# EAGLE design Final-V-0.1 (EAGLE 6.6.0)
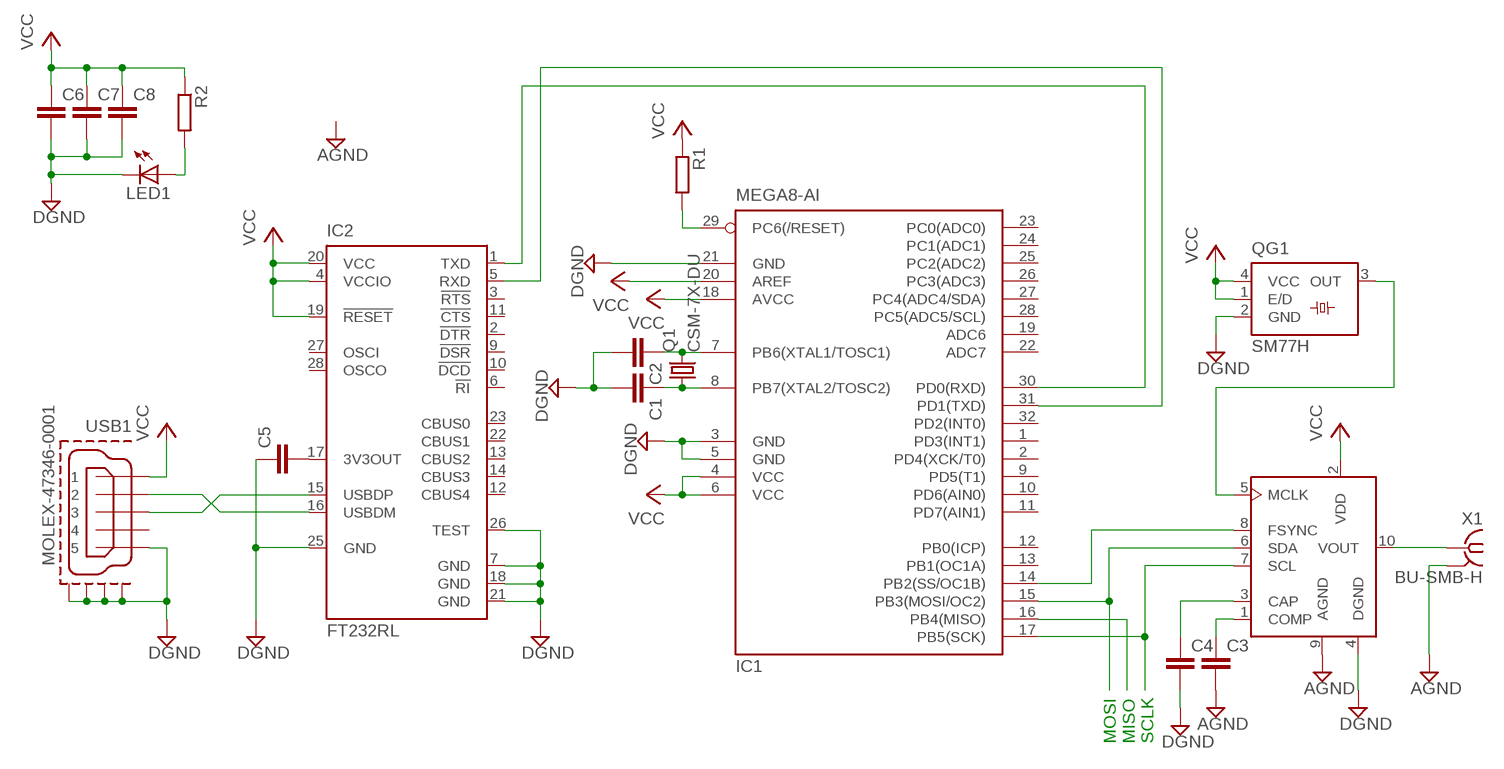
[diagram p0: schematic, sheet 1]

## Parts
C1  C-EUC1206K  [C1206K]
C2  C-EUC1206K  [C1206K]
C3  C-EUC1206K  [C1206K]
C4  C-EUC1206K  [C1206K]
C5  C-EUC1206K  [C1206K]
C6  C-EUC1206K  [C1206K]
C7  C-EUC1206K  [C1206K]
C8  C-EUC1206K  [C1206K]
IC1  MEGA8-AI  [TQFP32-08]
IC2  FT232RL  [SSOP28]
LED1  LEDSML1206  [SML1206]
Q1  CSM-7X-DU  [CSM-7X-DU]
QG1  SM77H  [SM77H]
R1  R-EU_M1206  [M1206]
R2  R-EU_M1206  [M1206]
U$1  AD9833-SMD  [MSOP10]
USB1  MOLEX-47346-0001  [MOLEX-47364-0001]
X1  BU-SMB-H  [BU-SMB-H]

## Nets
AGND: C3.2 U$1.9(AGND) X1.2 X1.3 X1.4 X1.5
DGND: C1.2 C2.2 C4.2 C5.1 C6.2 C7.2 C8.2 IC1.3(GND) IC1.5(GND) IC1.21(GND) IC2.7(GND) IC2.18(GND) IC2.21(GND) IC2.25(GND) IC2.26(TEST) LED1.C QG1.2(GND) U$1.4(DGND) USB1.5 USB1.GND1 USB1.GND2 USB1.GND3 USB1.GND4
N$1: C2.1 IC1.7(PB6(XTAL1/TOSC1)) Q1.2
N$2: C1.1 IC1.8(PB7(XTAL2/TOSC2)) Q1.1
N$3: C3.1 U$1.1(COMP)
N$4: IC1.17(PB5(SCK)) U$1.7(SCL)
N$5: IC1.29(PC6(/RESET)) R1.2
N$6: IC1.15(PB3(MOSI/OC2)) U$1.6(SDA)
N$7: IC1.14(PB2(SS/OC1B)) U$1.8(FSYNC)
N$8: IC1.16(PB4(MISO))
N$9: C4.1 U$1.3(CAP)
N$10: C5.2 IC2.17(3V3OUT)
N$11: QG1.3(OUT) U$1.5(MCLK)
N$12: U$1.10(VOUT) X1.1
N$13: IC1.30(PD0(RXD)) IC2.1(TXD)
N$14: IC1.31(PD1(TXD)) IC2.5(RXD)
N$15: IC2.16(USBDM) USB1.2
N$16: IC2.15(USBDP) USB1.3
N$17: LED1.A R2.2
VCC: C6.1 C7.1 C8.1 IC1.4(VCC) IC1.6(VCC) IC1.18(AVCC) IC1.20(AREF) IC2.4(VCCIO) IC2.19(!RESET) IC2.20(VCC) QG1.1(E/D) QG1.4(VCC) R1.1 R2.1 U$1.2(VDD) USB1.1
Unconnected: IC1.1(PD3(INT1)) IC1.2(PD4(XCK/T0)) IC1.9(PD5(T1)) IC1.10(PD6(AIN0)) IC1.11(PD7(AIN1)) IC1.12(PB0(ICP)) IC1.13(PB1(OC1A)) IC1.19(ADC6) IC1.22(ADC7) IC1.23(PC0(ADC0)) IC1.24(PC1(ADC1)) IC1.25(PC2(ADC2)) IC1.26(PC3(ADC3)) IC1.27(PC4(ADC4/SDA)) IC1.28(PC5(ADC5/SCL)) IC1.32(PD2(INT0)) IC2.2(!DTR) IC2.3(!RTS) IC2.6(!RI) IC2.9(!DSR) IC2.10(!DCD) IC2.11(!CTS) IC2.12(CBUS4) IC2.13(CBUS2) IC2.14(CBUS3) IC2.22(CBUS1) IC2.23(CBUS0) IC2.27(OSCI) IC2.28(OSCO) USB1.4

## Notes on the sheet
- MOSI
  MISO
  SCLK

## Library data of the parts
C1-C8 = rcl:C-EU: CAPACITOR, European symbol
IC1 = atmel:MEGA8: MICROCONTROLLER 8 Kbytes FLASH, 1 kbytes SRAM, 512 bytes EEPROM, USART, 6-channel 10 bit ADC, 2-channel 8 bit ADC Pin compatible with Atmega48, ATMega88, ATMega168 Source: avr.lbr; MPN: ATMEGA8-16AU; OC_FARNELL: 9171371; OC_NEWARK: 73M8863
IC2 = FT232:FT232R: Source: http://www.ftdichip.com/Documents/DataSheets/DS_FT232R_v104.pdf; MPN: FT232RL; OC_FARNELL: 1146032; OC_NEWARK: 91K9918
LED1 = led:LED: LED OSRAM: - CHIPLED LG R971, LG N971, LY N971, LG Q971, LY Q971, LO R971, LY R971 LH N974, LH R974 LS Q976, LO Q976, LY Q976 LO Q996 - Hyper CHIPLED LW Q18S LB Q993, LB Q99A, LB R99A - SideLED LS A670, LO A670, LY A670, LG A670, LP A670 LB A673, LV A673, LT A673, LW A673 LH A674 LY A675 LS A676, LA A676, LO A676, LY A676, LW A676 LS A679, LY A679, LG A679 - Hyper Micro SIDELED® LS Y876, LA Y876, LO Y876, LY Y876 LT Y87S - SmartLED LW L88C, LW L88S LB L89C, LB L89S, LG L890 LS L89K, LO L89K, LY L89K LS L896, LA L896, LO L896, LY L896 - TOPLED LS T670, LO T670, LY T670, LG T670, LP T670 LSG T670, LSP T670, LSY T670, LOP T670, LYG T670 LG T671, LOG T671, LSG T671 LB T673, LV T673, LT T673, LW T673 LH T674 LS T676, LA T676, LO T676, LY T676, LB T676, LH T676, LSB T676, LW T676 LB T67C, LV T67C, LT T67C, LS T67K, LO T67K, LY T67K, LW E67C LS E67B, LA E67B, LO E67B, LY E67B, LB E67C, LV E67C, LT E67C LW T67C LS T679, LY T679, LG T679 LS T770, LO T770, LY T770, LG T770, LP T770 LB T773, LV T773, LT T773, LW T773 LH T774 LS E675, LA E675, LY E675, LS T675 LS T776, LA T776, LO T776, LY T776, LB T776 LHGB T686 LT T68C, LB T68C - Hyper Mini TOPLED® LB M676 - Mini TOPLED Santana® LG M470 LS M47K, LO M47K, LY M47K Source: http://www.osram.convergy.de LUXEON: - LUMILED® LXK2-PW12-R00, LXK2-PW12-S00, LXK2-PW14-U00, LXK2-PW14-V00 LXK2-PM12-R00, LXK2-PM12-S00, LXK2-PM14-U00 LXK2-PE12-Q00, LXK2-PE12-R00, LXK2-PE12-S00, LXK2-PE14-T00, LXK2-PE14-U00 LXK2-PB12-K00, LXK2-PB12-L00, LXK2-PB12-M00, LXK2-PB14-N00, LXK2-PB14-P00, LXK2-PB14-Q00 LXK2-PR12-L00, LXK2-PR12-M00, LXK2-PR14-Q00, LXK2-PR14-R00 LXK2-PD12-Q00, LXK2-PD12-R00, LXK2-PD12-S00 LXK2-PH12-R00, LXK2-PH12-S00 LXK2-PL12-P00, LXK2-PL12-Q00, LXK2-PL12-R00 Source: www.luxeon.com KINGBRIGHT: KA-3528ASYC Source: www.kingbright.com
Q1 = crystal:CSM-7X-DU: SMD CRYSTAL Source: www.ecsxtal.com .. Crystal 3.6864MHz CSM_7X_DU.PDF; OC_FARNELL: unknown; OC_NEWARK: unknown
QG1 = crystal:SM77H: 3.3V CMOS Clock Oscillator Source: www.pletronics.com .. sm77h%203.3v.pdf; OC_FARNELL: unknown; OC_NEWARK: unknown
R1 R2 = rcl:R-EU_: RESISTOR, European symbol
U$1 = analog-devices:AD9833: AD9833 DDS-IC Information: analog.com
USB1 = usb_con-update:MOLEX-47346-0001: MICRO USB B, BOTTOM MOUNT
X1 = con-coax:BU-SMB-H: FEMALE SMB CONNECTOR Radiall distributor RS 112-3003; OC_FARNELL: unknown; OC_NEWARK: unknown

## Board
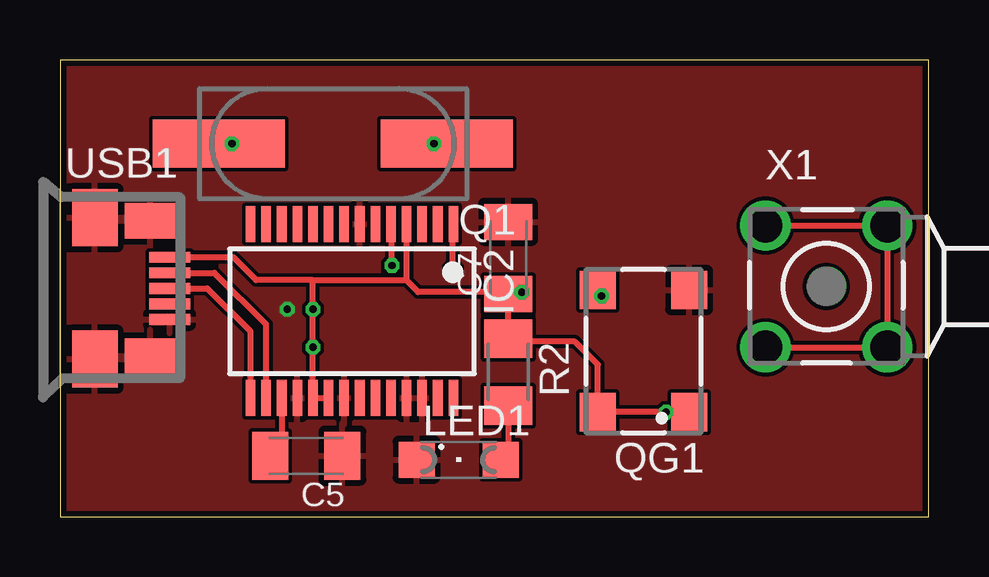
[diagram p1: board, top side]
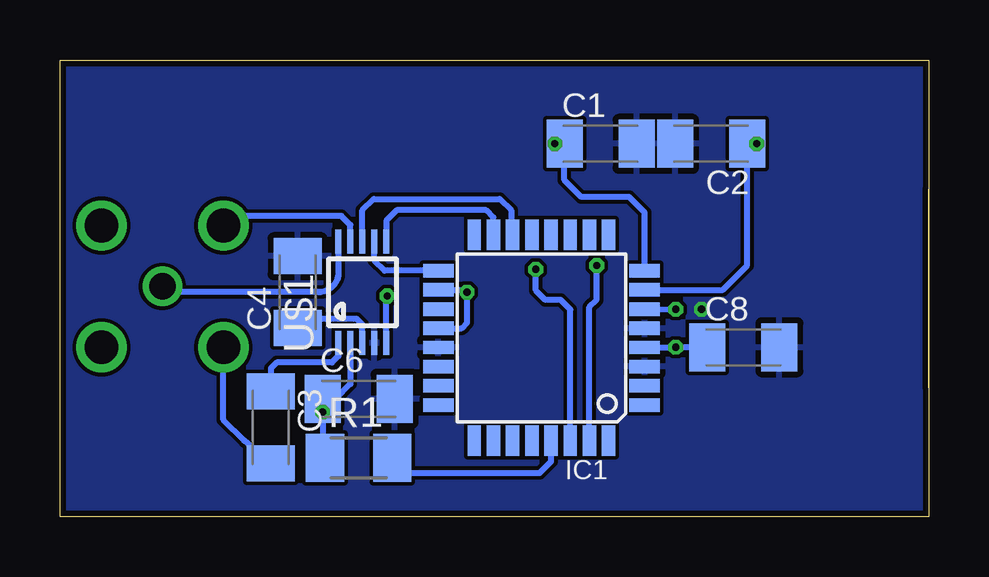
[diagram p2: board, bottom side, seen from below]

Size 36.2 x 19.05 mm. Coordinates in mm from the lower left corner, seen from the top.
Outline: 0,0 36.2,0 36.2,19.05 0,19.05 0,0
Copper layers (1*16): Top 0.035mm / dielectric 1.5mm / Bottom 0.035mm
Design rules "Elecrow_2-layer_eagle_rule": minimum track width 6mil, minimum drill 12mil, track to track 6mil, track to pad 6mil, pad to pad 6mil, via to via 6mil, smd to smd 0mil, copper to edge 10mil, drill to drill 10mil, minimum pad ring 10mil, minimum via ring 6mil, stop-mask expansion 2mil, vias tented up to drill 100mil, thermal gap 10mil

### Footprints (pad centres in the part's own frame; a part is rotated, then mirrored left to right if it is on the bottom)
C1206K = smd 1.5 x 2: 1 -1.5,0; 2 1.5,0
TQFP32-08 = smd 1.27 x 0.559: 1 -4.293,2.8; 2 -4.293,2; 3 -4.293,1.2; 4 -4.293,0.4; 5 -4.293,-0.4; 6 -4.293,-1.2; 7 -4.293,-2; 8 -4.293,-2.8; 17 4.293,-2.8; 18 4.293,-2; 19 4.293,-1.2; 20 4.293,-0.4; 21 4.293,0.4; 22 4.293,1.2; 23 4.293,2; 24 4.293,2.8 | smd 0.559 x 1.27: 9 -2.8,-4.293; 10 -2,-4.293; 11 -1.2,-4.293; 12 -0.4,-4.293; 13 0.4,-4.293; 14 1.2,-4.293; 15 2,-4.293; 16 2.8,-4.293; 25 2.8,4.293; 26 2,4.293; 27 1.2,4.293; 28 0.4,4.293; 29 -0.4,4.293; 30 -1.2,4.293; 31 -2,4.293; 32 -2.8,4.293
SSOP28 = smd 0.4 x 1.5: 1 -4.225,-3.625; 2 -3.575,-3.625; 3 -2.925,-3.625; 4 -2.275,-3.625; 5 -1.625,-3.625; 6 -0.975,-3.625; 7 -0.325,-3.625; 8 0.325,-3.625; 9 0.975,-3.625; 10 1.625,-3.625; 11 2.275,-3.625; 12 2.925,-3.625; 13 3.575,-3.625; 14 4.225,-3.625; 15 4.225,3.625; 16 3.575,3.625; 17 2.925,3.625; 18 2.275,3.625; 19 1.625,3.625; 20 0.975,3.625; 21 0.325,3.625; 22 -0.325,3.625; 23 -0.975,3.625; 24 -1.625,3.625; 25 -2.275,3.625; 26 -2.925,3.625; 27 -3.575,3.625; 28 -4.225,3.625
SML1206 = smd 1.5 x 1.5: A 1.75,0; C -1.75,0
CSM-7X-DU = smd 5.5 x 2: 1 -4.75,0; 2 4.75,0
SM77H = smd 1.6 x 1.5: 1 -2.55,-1.9; 2 2.55,-1.9; 3 2.55,1.9; 4 -2.55,1.9
M1206 = smd 1.6 x 2: 1 -1.4,0; 2 1.4,0
MSOP10 = smd 0.25 x 1: 1 -1,-2.113; 2 -0.5,-2.113; 3 0,-2.113; 4 0.5,-2.113; 5 1,-2.113; 6 1,2.113; 7 0.5,2.113; 8 0,2.113; 9 -0.5,2.113; 10 -1,2.113
MOLEX-47364-0001 = smd 1.7 x 0.45: 1 3.118,1.3; 2 3.118,0.65; 3 3.118,0; 4 3.118,-0.65; 5 3.118,-1.3 | smd 1.9 x 2.375: GND1 0,2.95; GND4 0,-2.95 | smd 2.1 x 1.475: GND2 2.3,2.817; GND3 2.3,-2.817
BU-SMB-H = drill 1.1: 1 0,0 | drill 1.4: 2 -2.54,2.54; 3 2.54,2.54; 4 2.54,-2.54; 5 -2.54,-2.54

### Placement (x,y rotation side)
C1  13.67,15.56 0 bottom
C2  9.07,15.56 180 bottom
C3  27.41,3.73 270 bottom
C4  26.29,9.37 90 bottom
C5  10.26,2.54 180 top
C6  23.75,4.92 0 bottom
C7  18.67,10.8 90 top
C8  7.72,7.07 0 bottom
IC1  16.13,7.46 180 bottom
IC2  12.17,8.58 180 top
LED1  16.61,2.38 0 top
Q1  11.37,15.56 180 top
QG1  24.31,6.91 90 top
R1  23.75,2.46 0 bottom
R2  18.67,6.04 270 top
U$1  23.6,9.37 0 bottom
USB1  1.45,9.53 0 top
X1  31.93,9.61 0 top

### Tracks (layer width: path | path; a pad name or v marks a point on that pad's centre or on a via)
AGND
  Top 0.254: X1.2 X1.3 X1.4 X1.5
  Bottom 0.254: U$1.9 24.1,12.17 24.47,12.54 28.99,12.54 X1.2 | C3.2 28.53,3.19 29.39,4.05 X1.5
DGND  (via drill 0.3)
  other vias: 9.47,8.65
  pour Top (isolate 0.152): 0.02,0 36.69,0 36.69,19.05 0.02,19.05
  pour Bottom (isolate 0.152): 0.02,0 36.69,0 36.69,19.05 0.02,19.05
N$1  (via drill 0.3)
  Top 0.254: v7.17,15.56 Q1.2
  Bottom 0.254: v7.17,15.56 C2.1 7.56,15.55 7.56,10.48 8.58,9.46 IC1.7
N$2  (via drill 0.3)
  Top 0.254: v15.58,15.56 Q1.1
  Bottom 0.254: v15.58,15.56 C1.1 15.18,15.55 15.18,14.05 14.47,13.34 12.48,13.34 11.84,12.7 IC1.8
N$3
  Bottom 0.254: U$1.1 24.6,6.7 24.87,6.43 27.17,6.43 27.41,6.19 C3.1
N$4
  Bottom 0.254: IC1.17 22.67,10.26 23.1,10.69 U$1.7
N$5
  Bottom 0.254: R1.2 21.72,1.83 16.21,1.83 15.74,2.3 IC1.29
N$6
  Bottom 0.254: IC1.15 18.13,12.48 18.44,12.78 22.17,12.78 22.6,12.35 U$1.6
N$7
  Bottom 0.254: U$1.8 23.6,12.78 23.12,13.26 17.88,13.26 17.4,12.78 17.4,11.83 IC1.14
N$9
  Bottom 0.254: U$1.3 23.6,8.02 23.83,8.26 25.91,8.26 C4.1
N$10
  Top 0.254: IC2.17 9.24,3.18 C5.2
N$11  (via drill 0.3)
  Top 0.254: v22.56,9.21 22.56,9.3 QG1.3
  Bottom 0.254: U$1.5 22.6,8.94 v22.56,9.21
N$12
  Bottom 0.254: U$1.10 24.6,10.19 arc90 25.42,9.37 31.69,9.37 arc90 X1.1
N$13  (via drill 0.3)
  Top 0.254: v16.37,10.32 16.37,12.18 IC2.1
  Bottom 0.254: IC1.30 14.93,8.65 15.34,9.05 15.98,9.05 16.37,9.45 v16.37,10.32
N$14  (via drill 0.3)
  Top 0.254: v13.83,10.48 13.83,12.16 IC2.5
  Bottom 0.254: IC1.31 14.13,8.75 13.83,9.05 v13.83,10.48
N$15
  Top 0.254: USB1.2 6.44,10.18 8.59,8.02 IC2.16
N$16
  Top 0.254: USB1.3 6.13,9.53 7.94,7.72 IC2.15
N$17
  Top 0.254: R2.2 18.67,2.7 LED1.A
VCC  (via drill 0.3)
  Top 0.254: IC2.20 IC2.19 v10.54,7.07 v10.54,8.65 10.54,9.88 | C7.1 R2.1 18.8,7.31 21.45,7.31 22.41,6.35 QG1.4 v25.25,4.37 25.26,4.36 QG1.1 | v19.24,9.37 C7.1 | v19.24,9.37 14.92,9.37 14.44,9.84 | 14.44,9.84 IC2.4 | USB1.1 7.21,10.83 8.17,9.88 10.54,9.88 | 10.54,9.88 14.41,9.88 14.44,9.84 | v19.24,9.37 18.75,9.37 C7.1
  Bottom 0.254: IC1.4 v10.54,7.07 C8.1 | IC1.6 v10.54,8.65 | IC1.18 19.33,9.46 v19.24,9.37 19.23,9.36 19.23,8.1 19.47,7.86 IC1.20 | U$1.2 24.1,5.53 24.71,4.92 C6.1 v25.25,4.37 25.25,2.56 R1.1